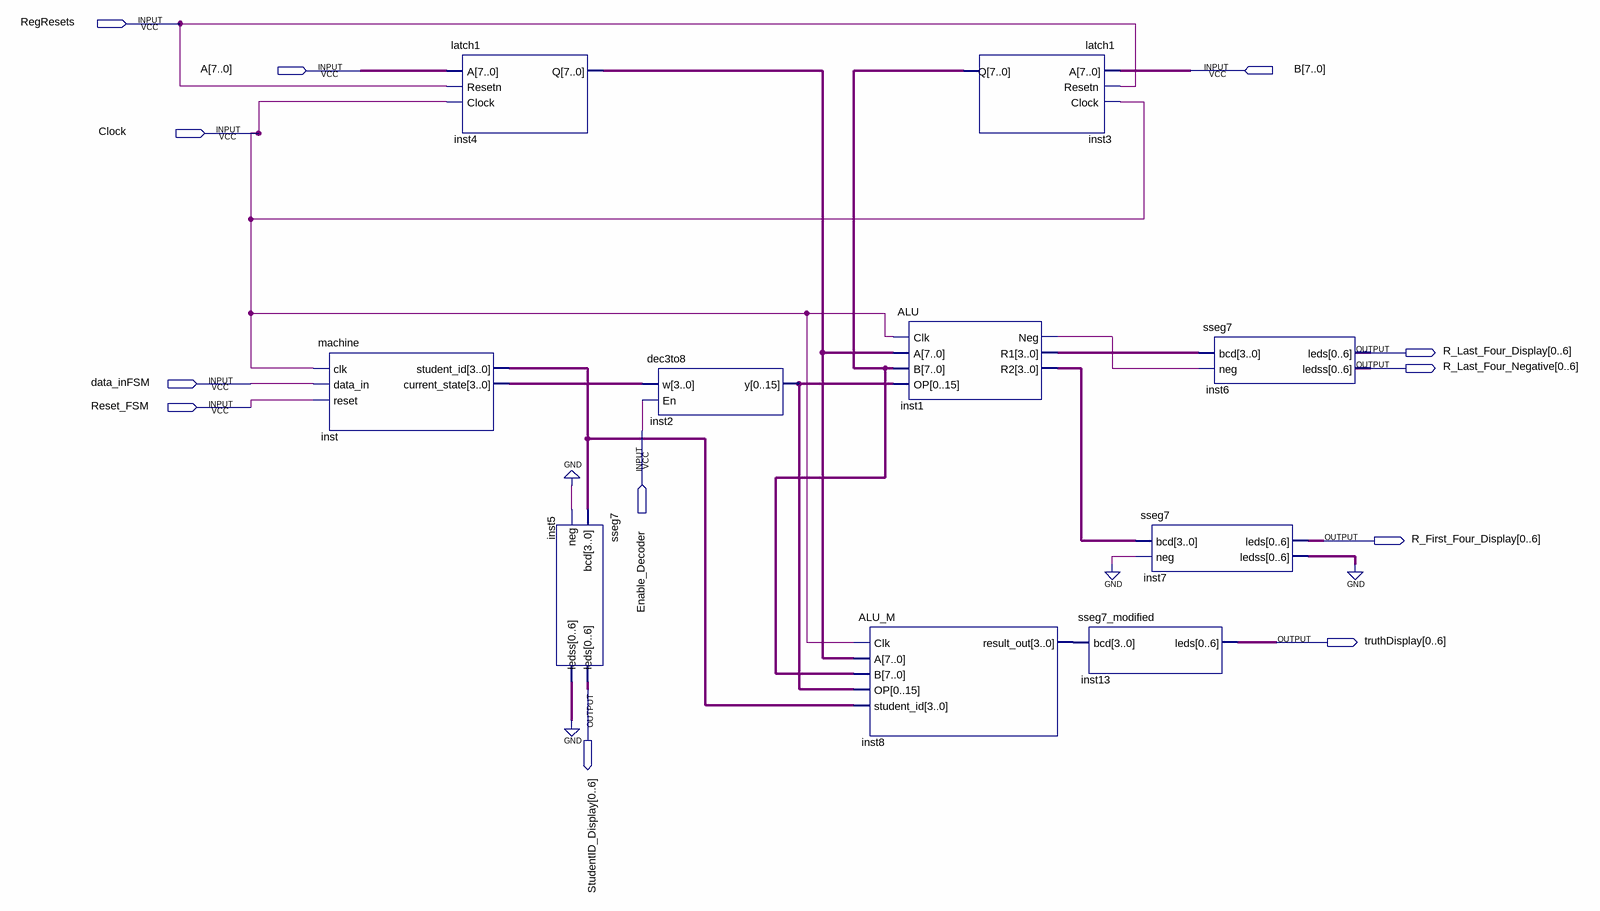
[diagram p0: schematic sheet]
// Quartus schematic lab6.bdf as structural Verilog: 10 symbols, 12 pins
module lab6 (
  input  RegResets,
  input  [7:0] A,
  input  [7:0] B,
  input  Clock,
  input  data_inFSM,
  input  Reset_FSM,
  input  Enable_Decoder,
  output [0:6] R_Last_Four_Display,
  output [0:6] R_Last_Four_Negative,
  output [0:6] R_First_Four_Display,
  output [0:6] truthDisplay,
  output [0:6] StudentID_Display
);

  wire inst1_neg;
  wire [3:0] inst1_r1, inst1_r2, inst8_result_out, inst_current_state, inst_student_id;
  wire [6:0] inst5_ledss, inst7_ledss;
  wire [7:0] inst3_q, inst4_q;
  wire [15:0] inst2_y;

  machine inst (
    .clk(Clock), .data_in(data_inFSM), .reset(Reset_FSM), .student_id(inst_student_id),
    .current_state(inst_current_state));
  latch1 inst4 (.A(A), .Resetn(RegResets), .Clock(Clock), .Q(inst4_q));
  sseg7 inst5 (.bcd(inst_student_id), .neg(1'b0), .leds(StudentID_Display), .ledss(inst5_ledss));
  dec3to8 inst2 (.w(inst_current_state), .En(Enable_Decoder), .y(inst2_y));
  ALU_M inst8 (
    .Clk(Clock), .A(inst4_q), .B(inst3_q), .OP(inst2_y), .student_id(inst_student_id),
    .result_out(inst8_result_out));
  ALU inst1 (.Clk(Clock), .A(inst4_q), .B(inst3_q), .OP(inst2_y), .Neg(inst1_neg), .R1(inst1_r1), .R2(inst1_r2));
  latch1 inst3 (.A(B), .Resetn(RegResets), .Clock(Clock), .Q(inst3_q));
  sseg7_modified inst13 (.bcd(inst8_result_out), .leds(truthDisplay));
  sseg7 inst7 (.bcd(inst1_r2), .neg(1'b0), .leds(R_First_Four_Display), .ledss(inst7_ledss));
  sseg7 inst6 (.bcd(inst1_r1), .neg(inst1_neg), .leds(R_Last_Four_Display), .ledss(R_Last_Four_Negative));
  // also tied to GND on the sheet: {inst5_ledss[0], inst5_ledss[1], inst5_ledss[2], inst5_ledss[3], inst5_ledss[4], inst5_ledss[5], inst5_ledss[6], inst7_ledss[0], inst7_ledss[1], inst7_ledss[2], inst7_ledss[3], inst7_ledss[4], inst7_ledss[5], inst7_ledss[6]}
endmodule
